# EAGLE design fablab_example_board_v2 (EAGLE 8.7.1)
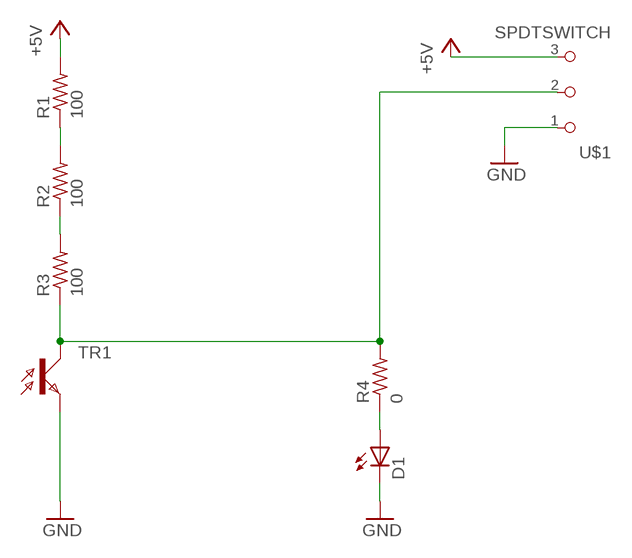
[diagram p0: schematic, sheet 1]

## Parts
D1  LEDFAB1206  [LED1206FAB]
R1  100  RES-US1206FAB  [R1206FAB]
R2  100  RES-US1206FAB  [R1206FAB]
R3  100  RES-US1206FAB  [R1206FAB]
R4  0  RES-US1206FAB  [R1206FAB]
TR1  PHOTOTRANSISTOR-NPN1206  [OP1206]
U$1  SPDTSWITCH  [SPDTSWITCH]

## Nets
+5V: R1.2 U$1.3
GND: D1.2(C) TR1.E U$1.1
N$1: R2.1 R3.2
N$2: R1.1 R2.2
N$3: R3.1 R4.2 TR1.C U$1.2
N$4: D1.1(A) R4.1

## Library data of the parts
D1 = fab:LED: LED
R1-R4 = fab:RES-US: Resistor (US Symbol) Variants with postfix FAB are widened to allow the routing of internal traces
TR1 = fab:PHOTOTRANSISTOR-NPN
U$1 = fab:SPDTSWITCH

## Board
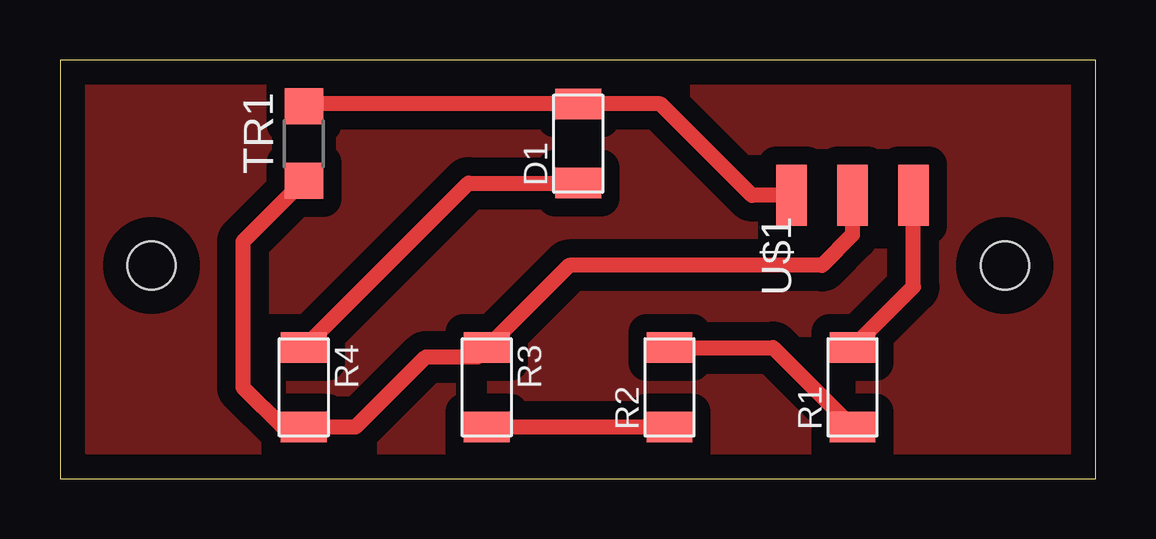
[diagram p1: board, top side]

Size 43.16 x 17.45 mm. Coordinates in mm from the lower left corner, seen from the top.
Outline: 0,0 43.16,0 43.16,17.45 0,17.45 0,0
Copper layers (1*16): Top 0.035mm / dielectric 1.5mm / Bottom 0.035mm
Design rules "default *": minimum track width 6mil, minimum drill 0.35mm, track to track 30mil, track to pad 30mil, pad to pad 30mil, via to via 6mil, smd to smd 30mil, copper to edge 40mil, drill to drill 6mil, minimum pad ring 10mil, minimum via ring 8mil, stop-mask expansion 4mil, vias tented up to drill 0mil, thermal gap 16mil
Holes 2 mm at 39.37,8.89 3.81,8.89

### Footprints (pad centres in the part's own frame; a part is rotated, then mirrored left to right if it is on the bottom)
LED1206FAB = smd 1.27 x 1.905: 1 -1.651,0; 2 1.651,0
R1206FAB = smd 1.27 x 1.905: 1 -1.651,0; 2 1.651,0
OP1206 = smd 1.5 x 1.6: C -1.55,0; E 1.55,0
SPDTSWITCH = smd 2.54 x 1.27: 1 0.38,2.54; 2 0.38,0; 3 0.38,-2.54

### Placement (x,y rotation side)
D1  21.59,13.97 90 top
R1  33.02,3.81 90 top
R2  25.4,3.81 90 top
R3  17.78,3.81 270 top
R4  10.16,3.81 270 top
TR1  10.16,13.97 90 top
U$1  33.02,11.43 90 top

### Tracks (layer width: path | path; a pad name or v marks a point on that pad's centre or on a via)
+5V
  Top 0.635: R1.2 35.56,8 U$1.3
GND
  Top 0.635: TR1.E 10.26,15.62 D1.2 25.02,15.62 28.83,11.81 U$1.1
N$1
  Top 0.635: R3.2 R2.1
N$2
  Top 0.635: R2.2 29.72,5.46 R1.1
N$3
  Top 0.635: TR1.C 7.62,9.88 7.62,3.81 9.27,2.16 R4.2 12.32,2.16 15.24,5.08 17.4,5.08 17.59,5.27 R3.1 21.21,8.89 31.75,8.89 33.02,10.16 U$1.2
N$4
  Top 0.635: R4.1 17.02,12.32 D1.1
N$5
  pour Top: 1.27,16.51 1.27,1.27 41.91,1.27 41.91,16.51